# Altium schematic sheet AUAV_X05_NRF24.SchDoc
size 209 x 148 mm
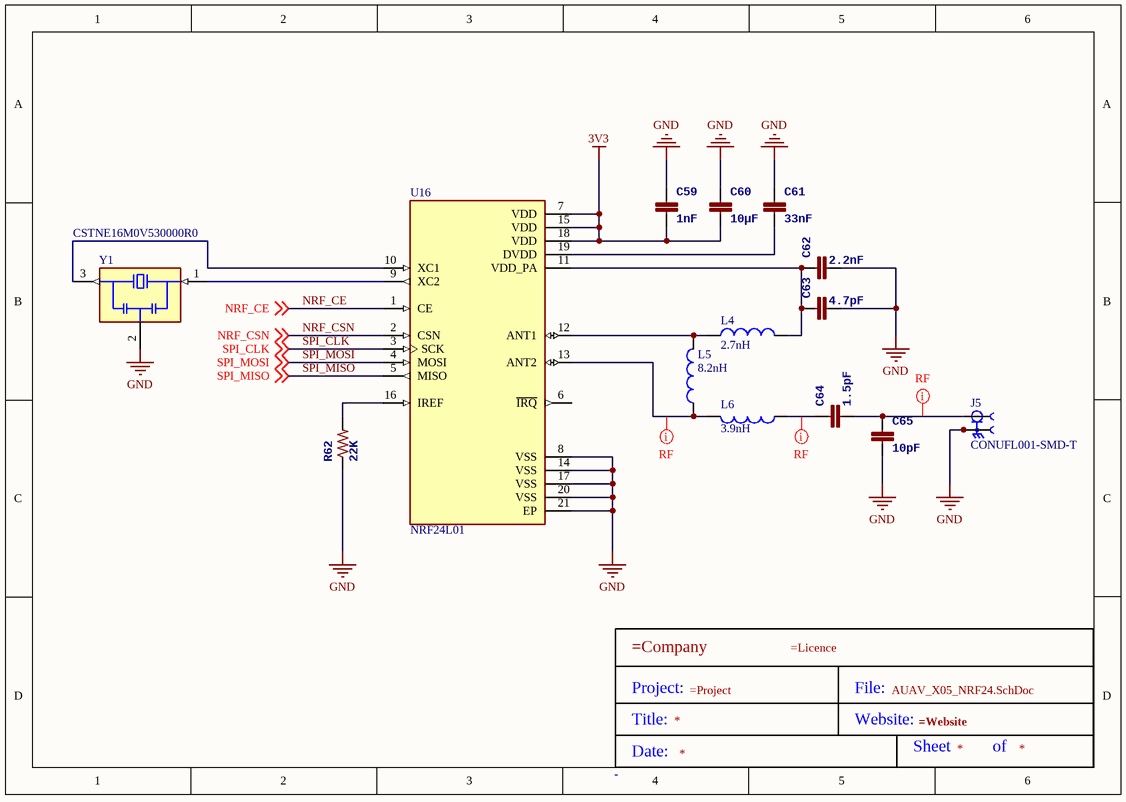
[diagram p0: AUAV_X05_NRF24.SchDoc]

## Parts
*?  Title Block  (value not drawn)
C59  1nF  [0402-CAP]
C60  10µF  [0805-CAP]
C61  33nF  [0402-CAP]
C62  2.2nF  [0402-CAP]
C63  4.7pF  [0402-CAP]
C64  1.5pF  [0402-CAP]
C65  10pF  [0402-CAP]
J5  CONUFL001-SMD-T  [LINX_CONUFL001-SMD-T]
L4  2.7nH  [INDC1005X65N]
L5  8.2nH  [INDC1005X65N]
L6  3.9nH  [INDC1005X65N]
R62  22K  [0402-RES]
U16  NRF24L01  [QFN50P400X400X95-21N]
Y1  CSTNE16M0V530000R0  [OSC_CSTNE16M0V530000R0]

## Nets
3V3: C59.P$2 C60.P$2 U16.7(VDD) U16.15(VDD) U16.18(VDD)
GND: C59.P$1 C60.P$1 C61.P$1 C62.P$2 C63.P$2 C65.P$2 J5.2 J5.3 R62.P$1 U16.8(VSS) U16.14(VSS) U16.17(VSS) U16.20(VSS) U16.21(EP) Y1.2(GND)
NRF_CE: U16.1(CE) ; off-sheet NRF_CE
NRF_CSN: U16.2(CSN) ; off-sheet NRF_CSN
SPI_CLK: U16.3(SCK) ; off-sheet SPI_CLK
SPI_MISO: U16.5(MISO) ; off-sheet SPI_MISO
SPI_MOSI: U16.4(MOSI) ; off-sheet SPI_MOSI
NetC61_P$2: C61.P$2 U16.19(DVDD)
NetC62_P$1: C62.P$1 C63.P$1 L4.2 U16.11(VDD_PA)
NetC64_P$1: C64.P$1 L6.1
NetC64_P$2: C64.P$2 C65.P$1 J5.1
NetL4_1: L4.1 L5.2 U16.12(ANT1)
NetL5_1: L5.1 L6.2 U16.13(ANT2)
NetR62_P$2: R62.P$2 U16.16(IREF)
NetU16_9: U16.9(XC2) Y1.1(IN)
NetU16_10: U16.10(XC1) Y1.3(OUT)

Not connected (* = marked no-connect by the designer): U16 6(~{IRQ})

## Layout directives
net class RF: NetC64_P$1, NetC64_P$2, NetL5_1

## Notes on the sheet
- (in symbol Title Block) Project:; File:; Title:; Website:; Sheet; of; Date:

## Library data of the parts
C59 C61-C65 = CAP0402: CAP CER 8PF 50V C0G 0402; PARTNO: C1005C0G1H080C; 3DR_PARTNO: ECM0710; Value: 8p; Supplier 1: Digi-Key; Supplier Part Number 1: 445-4890-1-ND
C60 = CAP0805: CAP CER 4.7UF 16V 10% X7R 0805; PARTNO: CL21B475KOFNNNE; 3DR_PARTNO: ECM0622; Value: 4u7; DATASHEET: http://www.digikey.com/product-detail/en/CL21B475KOFNNNE/1276-2873-2-ND/3888531; Supplier 1: Digi-Key; Supplier Part Number 1: 1276-2873-1-ND
J5 = CONUFL001-SMD-T: MHF1 Straight Surface Mount Jack, Tape and Reel; MF: Linx Technologies; SnapEDA_Link: https://www.snapeda.com/parts/CONUFL001-SMD-T/Linx+Technologies+Inc./view-part/?ref=snap; Availability: In Stock; Purchase-URL: https://pricing.snapeda.com/search/part/CONUFL001-SMD-T/?ref=eda; MP: CONUFL001-SMD-T; Value: *; Price: None; Package: None; Check_prices: https://www.snapeda.com/parts/CONUFL001-SMD-T/Linx+Technologies+Inc./view-part/?ref=eda
L4-L6 = IND0402: 39nH Unshielded Multilayer Inductor 200mA 1.3Ohm Max 0402 (1005 Metric); MP: AIMC-0402-39NJ-T; MF: Abracon LLC; Package: 0402-2 Abracon; Availability: In Stock; Value: *; SnapEDA_Link: https://www.snapeda.com/parts/AIMC-0402-39NJ-T/Abracon%20LLC/view-part/1612276/?ref=snap; Price: None; Purchase-URL: https://pricing.snapeda.com/search/part/AIMC-0402-39NJ-T/?ref=eda; Check_prices: https://www.snapeda.com/parts/AIMC-0402-39NJ-T/Abracon%20LLC/view-part/1612276/?ref=eda
R62 = RESISTOR0402-RES: RES 10K OHM 1/16W 1% 0402 SMD; PARTNO: RC0402FR-0710KL; 3DR_PARTNO: ECM0800; Supplier 1: Digi-Key; Value: 10K; Supplier Part Number 1: 311-10.0KLRCT-ND
U16 = NRF24L01: IC RF TxRx Only General ISM > 1GHZ 2.4GHz 20-VFQFN Exposed Pad; MP: NRF24L01+; MF: Nordic Semiconductor; Availability: Unavailable; Package: QFN-20 Nordic Semiconductor; SnapEDA_Link: https://www.snapeda.com/parts/NRF24L01%2B/Nordic%20Semiconductor%20ASA/view-part/1023904/?ref=snap; Value: *; Price: None
Y1 = CSTNE16M0V530000R0: 16MHz Ceramic Resonator Built in Capacitor 15pF Â±0.3% 40 Ohms -40Â°C ~ 85Â°C Surface Mount; MF: Murata Electronics; Check_prices: https://www.snapeda.com/parts/CSTNE16M0V530000R0/Murata%20Electronics%20North%20America/view-part/2773601/?ref=eda; Purchase-URL: https://pricing.snapeda.com/search/part/CSTNE16M0V530000R0/?ref=eda; SnapEDA_Link: https://www.snapeda.com/parts/CSTNE16M0V530000R0/Murata%20Electronics%20North%20America/view-part/2773601/?ref=snap; Price: None; Value: *; MP: CSTNE16M0V530000R0; Package: SMD-3 Murata; Availability: Warning
*? = Title Block: Size: -